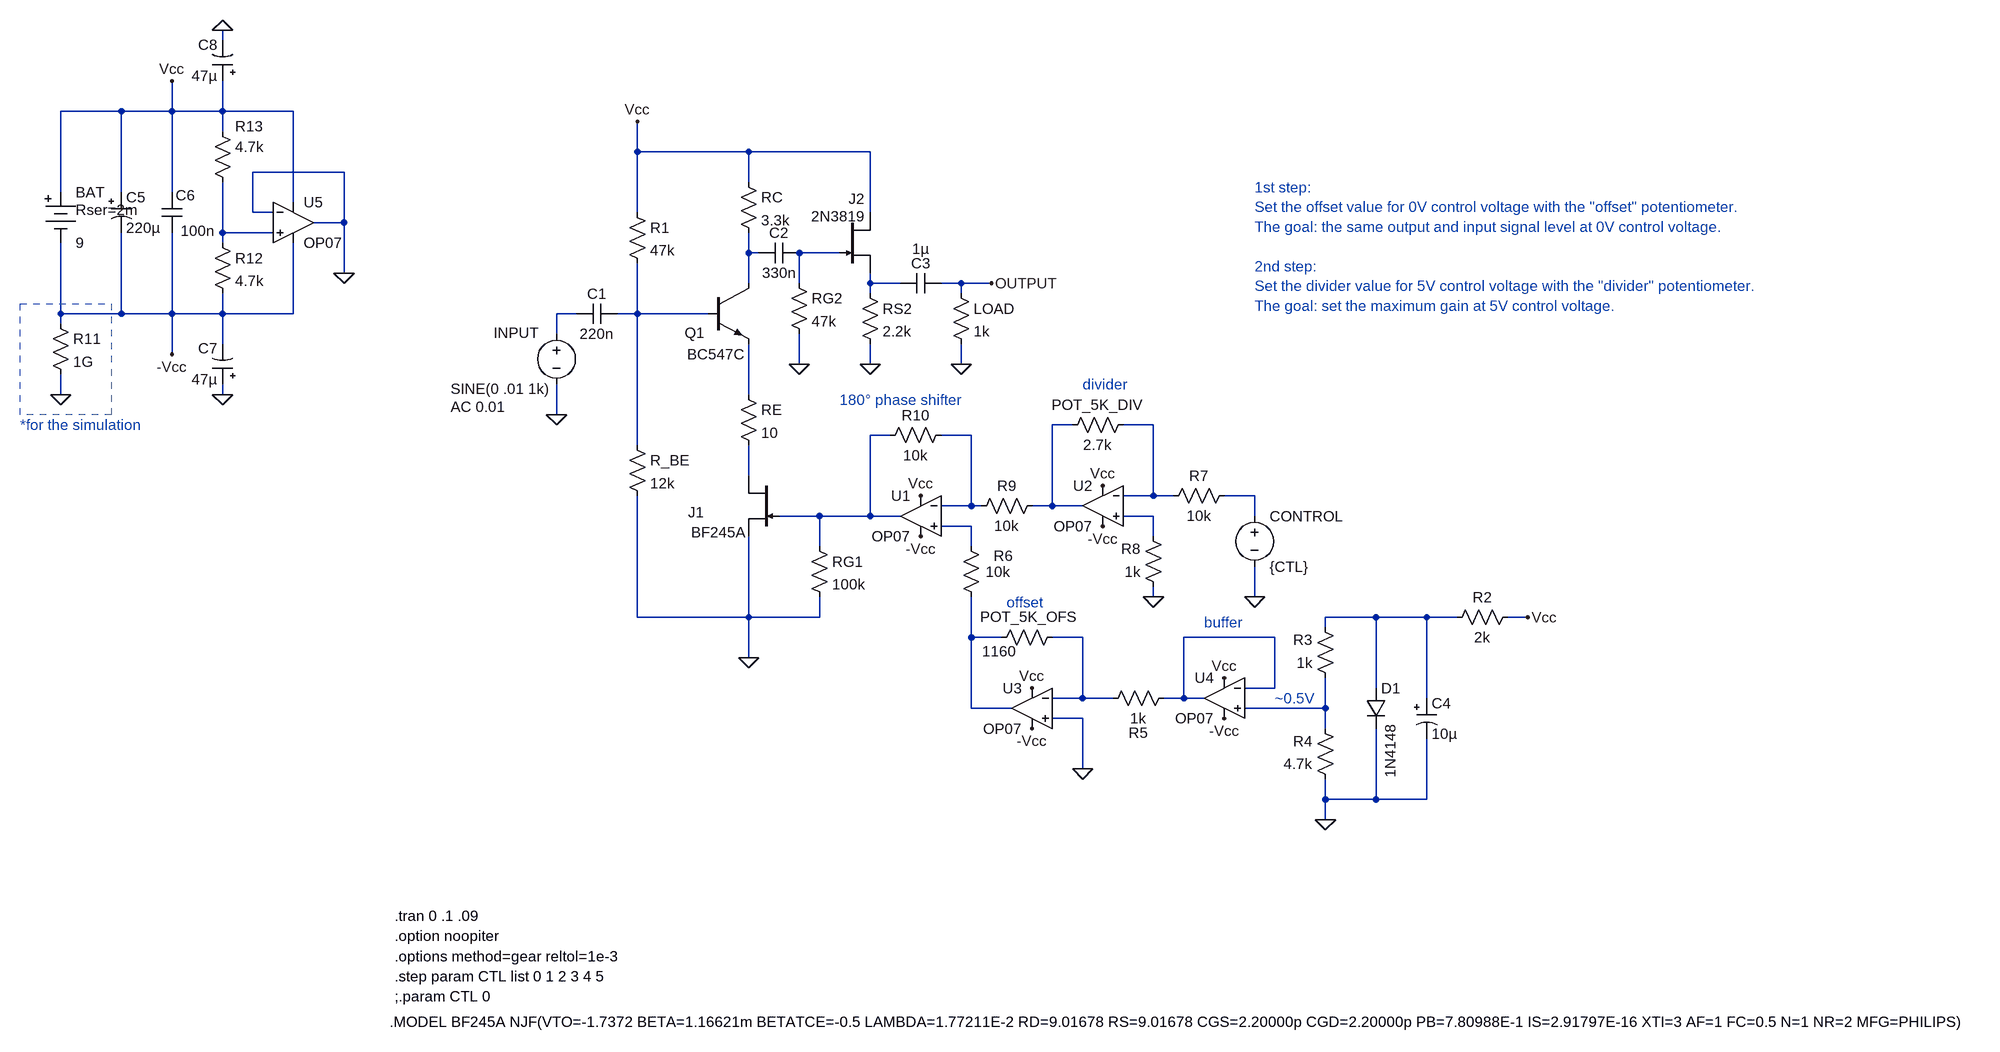
[diagram p0: schematic agc-01.asc]
agc-01.asc, the LTspice schematic file:
Version 4.1
SHEET 1 3412 1056
WIRE -608 -512 -608 -528
WIRE -768 -400 -864 -400
WIRE -688 -400 -688 -448
WIRE -688 -400 -768 -400
WIRE -608 -400 -608 -448
WIRE -608 -400 -688 -400
WIRE -496 -400 -608 -400
WIRE -608 -368 -608 -400
WIRE 48 -336 48 -384
WIRE 224 -336 48 -336
WIRE 416 -336 224 -336
WIRE -416 -304 -560 -304
WIRE 224 -288 224 -336
WIRE -864 -272 -864 -400
WIRE -768 -272 -768 -400
WIRE -688 -272 -688 -400
WIRE -496 -256 -496 -400
WIRE -560 -240 -560 -304
WIRE -528 -240 -560 -240
WIRE 48 -240 48 -336
WIRE 416 -240 416 -336
WIRE -416 -224 -416 -304
WIRE -416 -224 -464 -224
WIRE -608 -208 -608 -288
WIRE -528 -208 -608 -208
WIRE -608 -192 -608 -208
WIRE 224 -176 224 -208
WIRE 240 -176 224 -176
WIRE 368 -176 304 -176
WIRE -416 -144 -416 -224
WIRE 224 -128 224 -176
WIRE 304 -128 304 -176
WIRE 416 -128 416 -144
WIRE 464 -128 416 -128
WIRE 560 -128 528 -128
WIRE 608 -128 560 -128
WIRE 416 -112 416 -128
WIRE 560 -112 560 -128
WIRE -864 -80 -864 -192
WIRE -768 -80 -768 -208
WIRE -768 -80 -864 -80
WIRE -688 -80 -688 -208
WIRE -688 -80 -768 -80
WIRE -608 -80 -608 -112
WIRE -608 -80 -688 -80
WIRE -496 -80 -496 -192
WIRE -496 -80 -608 -80
WIRE -48 -80 -80 -80
WIRE 48 -80 48 -160
WIRE 48 -80 16 -80
WIRE 160 -80 48 -80
WIRE -864 -64 -864 -80
WIRE -80 -48 -80 -80
WIRE -608 -32 -608 -80
WIRE -688 -16 -688 -80
WIRE 304 0 304 -48
WIRE 416 0 416 -32
WIRE 560 0 560 -32
WIRE -864 48 -864 16
WIRE -608 48 -608 32
WIRE 224 48 224 -32
WIRE -80 80 -80 32
WIRE 736 96 704 96
WIRE 864 96 816 96
WIRE 448 112 416 112
WIRE 576 112 528 112
WIRE 48 128 48 -80
WIRE 224 176 224 128
WIRE 864 208 864 96
WIRE 864 208 816 208
WIRE 896 208 864 208
WIRE 1024 208 976 208
WIRE 576 224 576 112
WIRE 576 224 528 224
WIRE 592 224 576 224
WIRE 704 224 704 96
WIRE 704 224 672 224
WIRE 752 224 704 224
WIRE 336 240 272 240
WIRE 416 240 416 112
WIRE 416 240 336 240
WIRE 464 240 416 240
WIRE 864 240 816 240
WIRE 1024 240 1024 208
WIRE 576 256 528 256
WIRE 864 272 864 240
WIRE 336 288 336 240
WIRE 576 288 576 256
WIRE 864 368 864 352
WIRE 1024 368 1024 320
WIRE 48 400 48 208
WIRE 224 400 224 272
WIRE 224 400 48 400
WIRE 336 400 336 368
WIRE 336 400 224 400
WIRE 1216 400 1136 400
WIRE 1296 400 1216 400
WIRE 1344 400 1296 400
WIRE 1456 400 1424 400
WIRE 1136 416 1136 400
WIRE 576 432 576 368
WIRE 624 432 576 432
WIRE 752 432 704 432
WIRE 1056 432 912 432
WIRE 224 464 224 400
WIRE 1056 512 1056 432
WIRE 1056 512 1008 512
WIRE 1216 512 1216 400
WIRE 752 528 752 432
WIRE 752 528 704 528
WIRE 800 528 752 528
WIRE 912 528 912 432
WIRE 912 528 880 528
WIRE 944 528 912 528
WIRE 1296 528 1296 400
WIRE 576 544 576 432
WIRE 640 544 576 544
WIRE 1136 544 1136 496
WIRE 1136 544 1008 544
WIRE 752 560 704 560
WIRE 1136 576 1136 544
WIRE 752 640 752 560
WIRE 1136 688 1136 656
WIRE 1216 688 1216 576
WIRE 1216 688 1136 688
WIRE 1296 688 1296 592
WIRE 1296 688 1216 688
WIRE 1136 720 1136 688
FLAG 48 -384 Vcc
FLAG -80 80 0
FLAG 784 192 Vcc
FLAG 1024 368 0
FLAG 496 208 Vcc
FLAG 672 512 Vcc
FLAG 1456 400 Vcc
FLAG 976 496 Vcc
FLAG 416 0 0
FLAG 608 -128 OUTPUT
FLAG 560 0 0
FLAG -688 -448 Vcc
FLAG 976 560 -Vcc
FLAG 672 576 -Vcc
FLAG 784 256 -Vcc
FLAG 496 272 -Vcc
FLAG 752 640 0
FLAG 224 464 0
FLAG 864 368 0
FLAG 1136 720 0
FLAG -864 48 0
FLAG 304 0 0
FLAG -416 -144 0
FLAG -688 -16 -Vcc
FLAG -608 48 0
FLAG -608 -528 0
SYMBOL npn 160 -128 R0
WINDOW 0 -37 78 Left 2
WINDOW 3 -33 112 Left 2
SYMATTR InstName Q1
SYMATTR Value BC547C
SYMBOL res 208 32 R0
SYMATTR InstName RE
SYMATTR Value 10
SYMBOL njf 272 176 M0
WINDOW 0 118 58 Left 2
WINDOW 3 52 90 Left 2
SYMATTR InstName J1
SYMATTR Value BF245A
SYMBOL res 32 -256 R0
SYMATTR InstName R1
SYMATTR Value 47k
SYMBOL res 32 112 R0
SYMATTR InstName R_BE
SYMATTR Value 12k
SYMBOL res 208 -304 R0
SYMATTR InstName RC
SYMATTR Value 3.3k
SYMBOL res 320 272 R0
SYMATTR InstName RG1
SYMATTR Value 100k
SYMBOL voltage -80 -64 R0
WINDOW 0 -99 14 Left 2
WINDOW 3 -167 103 Left 2
WINDOW 123 -167 131 Left 2
WINDOW 39 0 0 Left 0
SYMATTR InstName INPUT
SYMATTR Value SINE(0 .01 1k)
SYMATTR Value2 AC 0.01
SYMBOL voltage 1024 224 R0
WINDOW 123 0 0 Left 0
WINDOW 39 0 0 Left 0
SYMATTR InstName CONTROL
SYMATTR Value {CTL}
SYMBOL res 832 80 R90
WINDOW 0 0 56 VBottom 2
WINDOW 3 32 56 VTop 2
SYMATTR InstName POT_5K_DIV
SYMATTR Value 2.7k
SYMBOL res 880 368 R180
WINDOW 0 36 76 Left 2
WINDOW 3 36 40 Left 2
SYMATTR InstName R8
SYMATTR Value 1k
SYMBOL res 544 96 R90
WINDOW 0 0 56 VBottom 2
WINDOW 3 32 56 VTop 2
SYMATTR InstName R10
SYMATTR Value 10k
SYMBOL res 688 208 R90
WINDOW 0 0 56 VBottom 2
WINDOW 3 32 56 VTop 2
SYMATTR InstName R9
SYMATTR Value 10k
SYMBOL res 880 224 R270
WINDOW 0 32 56 VTop 2
WINDOW 3 0 56 VBottom 2
SYMATTR InstName R7
SYMATTR Value 10k
SYMBOL res 592 384 R180
WINDOW 0 -50 81 Left 2
WINDOW 3 -46 56 Left 2
SYMATTR InstName R6
SYMATTR Value 10k
SYMBOL res 896 512 R90
WINDOW 0 86 56 VBottom 2
WINDOW 3 32 56 VTop 2
SYMATTR InstName R5
SYMATTR Value 1k
SYMBOL res 720 416 R90
WINDOW 0 -1 52 VBottom 2
WINDOW 3 22 100 VTop 2
SYMATTR InstName POT_5K_OFS
SYMATTR Value 1160
SYMBOL cap 16 -96 R90
WINDOW 0 0 32 VBottom 2
WINDOW 3 32 32 VTop 2
SYMATTR InstName C1
SYMATTR Value 220n
SYMBOL res 1328 416 R270
WINDOW 0 32 56 VTop 2
WINDOW 3 0 56 VBottom 2
SYMATTR InstName R2
SYMATTR Value 2k
SYMBOL res 1152 512 R180
WINDOW 0 36 76 Left 2
WINDOW 3 36 40 Left 2
SYMATTR InstName R3
SYMATTR Value 1k
SYMBOL res 1152 672 R180
WINDOW 0 36 76 Left 2
WINDOW 3 36 40 Left 2
SYMATTR InstName R4
SYMATTR Value 4.7k
SYMBOL njf 368 -240 R0
WINDOW 0 14 -22 Left 2
WINDOW 3 -45 6 Left 2
SYMATTR InstName J2
SYMATTR Value 2N3819
SYMBOL res 288 -144 R0
SYMATTR InstName RG2
SYMATTR Value 47k
SYMBOL res 400 -128 R0
SYMATTR InstName RS2
SYMATTR Value 2.2k
SYMBOL cap 528 -144 R90
WINDOW 0 0 32 VBottom 2
WINDOW 3 -54 32 VTop 2
SYMATTR InstName C3
SYMATTR Value 1µ
SYMBOL res 544 -128 R0
SYMATTR InstName LOAD
SYMATTR Value 1k
SYMBOL diode 1200 512 R0
WINDOW 3 39 57 VRight 2
SYMATTR InstName D1
SYMATTR Value 1N4148
SYMBOL cap 304 -192 R90
WINDOW 0 0 32 VBottom 2
WINDOW 3 32 32 VTop 2
SYMATTR InstName C2
SYMATTR Value 330n
SYMBOL polcap 1280 528 R0
SYMATTR InstName C4
SYMATTR Value 10µ
SYMBOL Misc\\battery -864 -288 R0
WINDOW 123 0 0 Left 0
WINDOW 39 24 44 Left 2
SYMATTR InstName BAT
SYMATTR Value 9
SYMATTR SpiceLine Rser=2m
SYMBOL polcap -784 -272 R0
SYMATTR InstName C5
SYMATTR Value 220µ
SYMBOL cap -672 -208 R180
WINDOW 0 -21 59 Left 2
WINDOW 3 -52 3 Left 2
SYMATTR InstName C6
SYMATTR Value 100n
SYMBOL OpAmps\\OP07 496 176 M0
SYMATTR InstName U1
SYMBOL OpAmps\\OP07 784 160 M0
SYMATTR InstName U2
SYMBOL OpAmps\\OP07 672 480 M0
SYMATTR InstName U3
SYMBOL OpAmps\\OP07 976 464 M0
SYMATTR InstName U4
SYMBOL OpAmps\\OP07 -496 -288 R0
SYMATTR InstName U5
SYMBOL res -624 -208 R0
SYMATTR InstName R12
SYMATTR Value 4.7k
SYMBOL res -624 -384 R0
WINDOW 0 36 8 Left 2
WINDOW 3 36 40 Left 2
SYMATTR InstName R13
SYMATTR Value 4.7k
SYMBOL res -880 -80 R0
SYMATTR InstName R11
SYMATTR Value 1G
SYMBOL polcap -592 32 R180
WINDOW 0 24 57 Left 2
WINDOW 3 24 8 Left 2
SYMATTR InstName C7
SYMATTR Value 47µ
SYMBOL polcap -592 -448 R180
WINDOW 0 24 57 Left 2
WINDOW 3 24 8 Left 2
SYMATTR InstName C8
SYMATTR Value 47µ
TEXT -336 872 Left 2 !.tran 0 .1 .09
TEXT -336 904 Left 2 !.option noopiter
TEXT -336 936 Left 2 !.options method=gear reltol=1e-3
TEXT 632 376 Left 2 ;offset
TEXT 1056 528 Left 2 ;~0.5V
TEXT 752 32 Left 2 ;divider
TEXT 368 56 Left 2 ;180° phase shifter
TEXT 944 408 Left 2 ;buffer
TEXT -344 1040 Left 2 !.MODEL BF245A NJF(VTO=-1.7372 BETA=1.16621m BETATCE=-0.5 LAMBDA=1.77211E-2 RD=9.01678 RS=9.01678 CGS=2.20000p CGD=2.20000p PB=7.80988E-1 IS=2.91797E-16 XTI=3 AF=1 FC=0.5 N=1 NR=2 MFG=PHILIPS)
TEXT -336 968 Left 2 !.step param CTL list 0 1 2 3 4 5\n;.param CTL 0
TEXT 1024 -280 Left 2 ;1st step: \nSet the offset value for 0V control voltage with the "offset" potentiometer.\nThe goal: the same output and input signal level at 0V control voltage.\n \n2nd step:\nSet the divider value for 5V control voltage with the "divider" potentiometer.\nThe goal: set the maximum gain at 5V control voltage.
TEXT -928 96 Left 2 ;*for the simulation
RECTANGLE Normal -784 80 -928 -96 2

The netlist it stands for:
* agc-01.asc
Q1 N002 N006 N007 0 BC547C
RE N007 N012 10
J1 N012 N010 0 BF245A
R1 Vcc N006 47k
R_BE N006 0 12k
RC Vcc N002 3.3k
RG1 N010 0 100k
V§INPUT N005 0 SINE(0 .01 1k) AC 0.01
V§CONTROL N013 0 {CTL}
R§POT_5K_DIV N009 N008 2.7k
R8 0 N014 1k
R10 N011 N010 10k
R9 N008 N011 10k
R7 N009 N013 10k
R6 N017 N015 10k
R5 N019 N018 1k
R§POT_5K_OFS N018 N017 1160
C1 N006 N005 220n
R2 N016 Vcc 2k
R3 N020 N016 1k
R4 0 N020 4.7k
J2 Vcc N003 N004 2N3819
RG2 N003 0 47k
RS2 N004 0 2.2k
C3 OUTPUT N004 1µ
R§LOAD OUTPUT 0 1k
D1 N016 0 1N4148
C2 N003 N002 330n
C4 N016 0 10µ
V§BAT Vcc -Vcc 9 Rser=2m
C5 Vcc -Vcc 220µ
C6 -Vcc Vcc 100n
X§U1 N015 N011 Vcc -Vcc N010 LT1001  ; OP07, pins In+ In- V+ V- OUT
X§U2 N014 N009 Vcc -Vcc N008 LT1001  ; OP07, pins In+ In- V+ V- OUT
X§U3 0 N018 Vcc -Vcc N017 LT1001  ; OP07, pins In+ In- V+ V- OUT
X§U4 N020 N019 Vcc -Vcc N019 LT1001  ; OP07, pins In+ In- V+ V- OUT
X§U5 N001 0 Vcc -Vcc 0 LT1001  ; OP07, pins In+ In- V+ V- OUT
R12 N001 -Vcc 4.7k
R13 Vcc N001 4.7k
R11 -Vcc 0 1G
C7 0 -Vcc 47µ
C8 Vcc 0 47µ
.model D D
.lib standard.dio
.model NPN NPN
.model PNP PNP
.lib standard.bjt
.model NJF NJF
.model PJF PJF
.lib standard.jft
.tran 0 .1 .09
.option noopiter
.options method=gear reltol=1e-3
* offset
* ~0.5V
* divider
* 180° phase shifter
* buffer
.MODEL BF245A NJF(VTO=-1.7372 BETA=1.16621m BETATCE=-0.5 LAMBDA=1.77211E-2 RD=9.01678 RS=9.01678 CGS=2.20000p CGD=2.20000p PB=7.80988E-1 IS=2.91797E-16 XTI=3 AF=1 FC=0.5 N=1 NR=2 MFG=PHILIPS)
.step param CTL list 0 1 2 3 4 5
;.param CTL 0
* 1st step:
* Set the offset value for 0V control voltage with the "offset" potentiometer.
* The goal: the same output and input signal level at 0V control voltage.
* 2nd step:
* Set the divider value for 5V control voltage with the "divider" potentiometer.
* The goal: set the maximum gain at 5V control voltage.
* *for the simulation
.lib LTC.lib
.backanno
.end